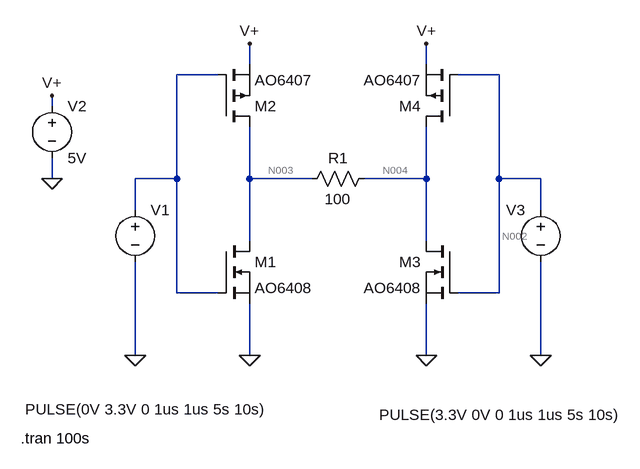
[diagram p0: schematic magnet_driver.asc]
magnet_driver.asc, the LTspice schematic file:
Version 4
SHEET 1 1320 680
WIRE 320 -96 320 -128
WIRE 592 -96 592 -128
WIRE 272 -80 208 -80
WIRE 704 -80 640 -80
WIRE 16 -32 16 -48
WIRE 16 80 16 48
WIRE 208 80 208 -80
WIRE 208 80 144 80
WIRE 320 80 320 0
WIRE 416 80 320 80
WIRE 592 80 592 0
WIRE 592 80 496 80
WIRE 704 80 704 -80
WIRE 768 80 704 80
WIRE 144 128 144 80
WIRE 768 128 768 80
WIRE 320 176 320 80
WIRE 592 176 592 80
WIRE 208 256 208 80
WIRE 272 256 208 256
WIRE 704 256 704 80
WIRE 704 256 640 256
WIRE 144 352 144 208
WIRE 320 352 320 272
WIRE 592 352 592 272
WIRE 768 352 768 208
FLAG 144 352 0
FLAG 16 80 0
FLAG 16 -48 V+
FLAG 320 -128 V+
FLAG 320 352 0
FLAG 592 -128 V+
FLAG 592 352 0
FLAG 768 352 0
SYMBOL voltage 144 112 R0
WINDOW 3 -169 323 Left 2
WINDOW 123 0 0 Left 2
WINDOW 39 0 0 Left 2
SYMATTR Value PULSE(0V 3.3V 0 1us 1us 5s 10s)
SYMATTR InstName V1
SYMBOL voltage 16 -48 R0
WINDOW 123 0 0 Left 2
WINDOW 39 0 0 Left 2
SYMATTR InstName V2
SYMATTR Value 5V
SYMBOL nmos 272 176 R0
SYMATTR InstName M1
SYMATTR Value AO6408
SYMBOL pmos 272 0 M180
SYMATTR InstName M2
SYMATTR Value AO6407
SYMBOL nmos 640 176 M0
SYMATTR InstName M3
SYMATTR Value AO6408
SYMBOL pmos 640 0 R180
SYMATTR InstName M4
SYMATTR Value AO6407
SYMBOL res 512 64 R90
WINDOW 0 0 56 VBottom 2
WINDOW 3 32 56 VTop 2
SYMATTR InstName R1
SYMATTR Value 100
SYMBOL voltage 768 112 M0
WINDOW 3 -121 332 Left 2
WINDOW 123 0 0 Left 2
WINDOW 39 0 0 Left 2
SYMATTR Value PULSE(3.3V 0V 0 1us 1us 5s 10s)
SYMATTR InstName V3
TEXT -32 480 Left 2 !.tran 100s

The netlist it stands for:
* magnet_driver.asc
V1 N001 0 PULSE(0V 3.3V 0 1us 1us 5s 10s)
V2 V+ 0 5V
M1 N003 N001 0 0 AO6408
M2 N003 N001 V+ V+ AO6407
M3 N004 N002 0 0 AO6408
M4 N004 N002 V+ V+ AO6407
R1 N004 N003 100
V3 N002 0 PULSE(3.3V 0V 0 1us 1us 5s 10s)
.model NMOS NMOS
.model PMOS PMOS
.lib standard.mos
.tran 100s
.backanno
.end

* Results of the author's LTspice run, read from the files saved beside the schematic
* Operating Point, zero values left out:
*   V(v+) = 5 V
*   V(n003) = 4.998 V
*   V(n004) = 136.9 mV
*   V(n002) = 3.3 V
*   Id(M4) = -10.19 A
*   Is(M4) = 10.19 A
*   Id(M2) = -48.62 mA
*   Is(M2) = 48.62 mA
*   Id(M3) = 10.24 A
*   Is(M3) = -10.24 A
*   Id(M1) = 968.5 pA
*   Is(M1) = -968.5 pA
*   I(R1) = -48.62 mA
*   I(V2) = -10.24 A
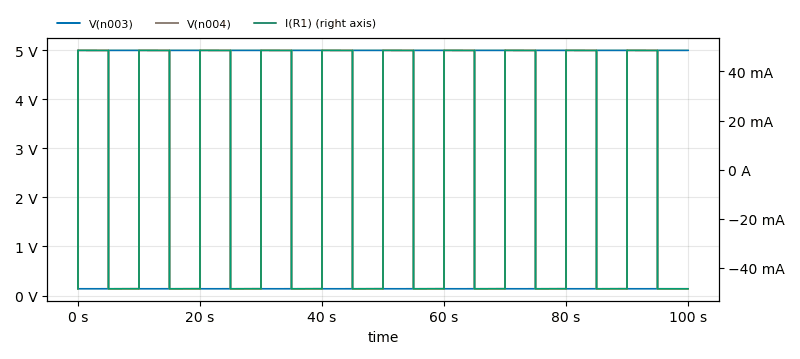
[diagram p1: Transient Analysis of magnet_driver.asc, plotted from the saved traces]
* Transient Analysis, 1 run:
*   V(n003): min 136.9 mV, max 4.999 V, average 2.568 V, rms 3.536 V, last 4.998 V
*   V(n004): min 136.9 mV, max 4.999 V, average 2.568 V, rms 3.536 V, last 136.9 mV
*   I(R1): min -48.62 mA, max 48.62 mA, average 9.723 nA, rms 48.62 mA, last -48.62 mA